# Altium schematic sheet RF Module.SchDoc: RF MODULE
size A3; Author: Andy Nicholson; CompanyName: WSU; DrawnBy: Andy Nicholson; Engineer: Andy Nicholson; Organization: WSU; DocumentNumber: 1; Revision: 2; SheetNumber: 2; SheetTotal: 3; Project: CC1125; ENG_APP_DATE: 2019/11/18; DSN_APP_DATE: 2019/11/18; CHK_APP_DATE: --/--/--; ImagePath: 1
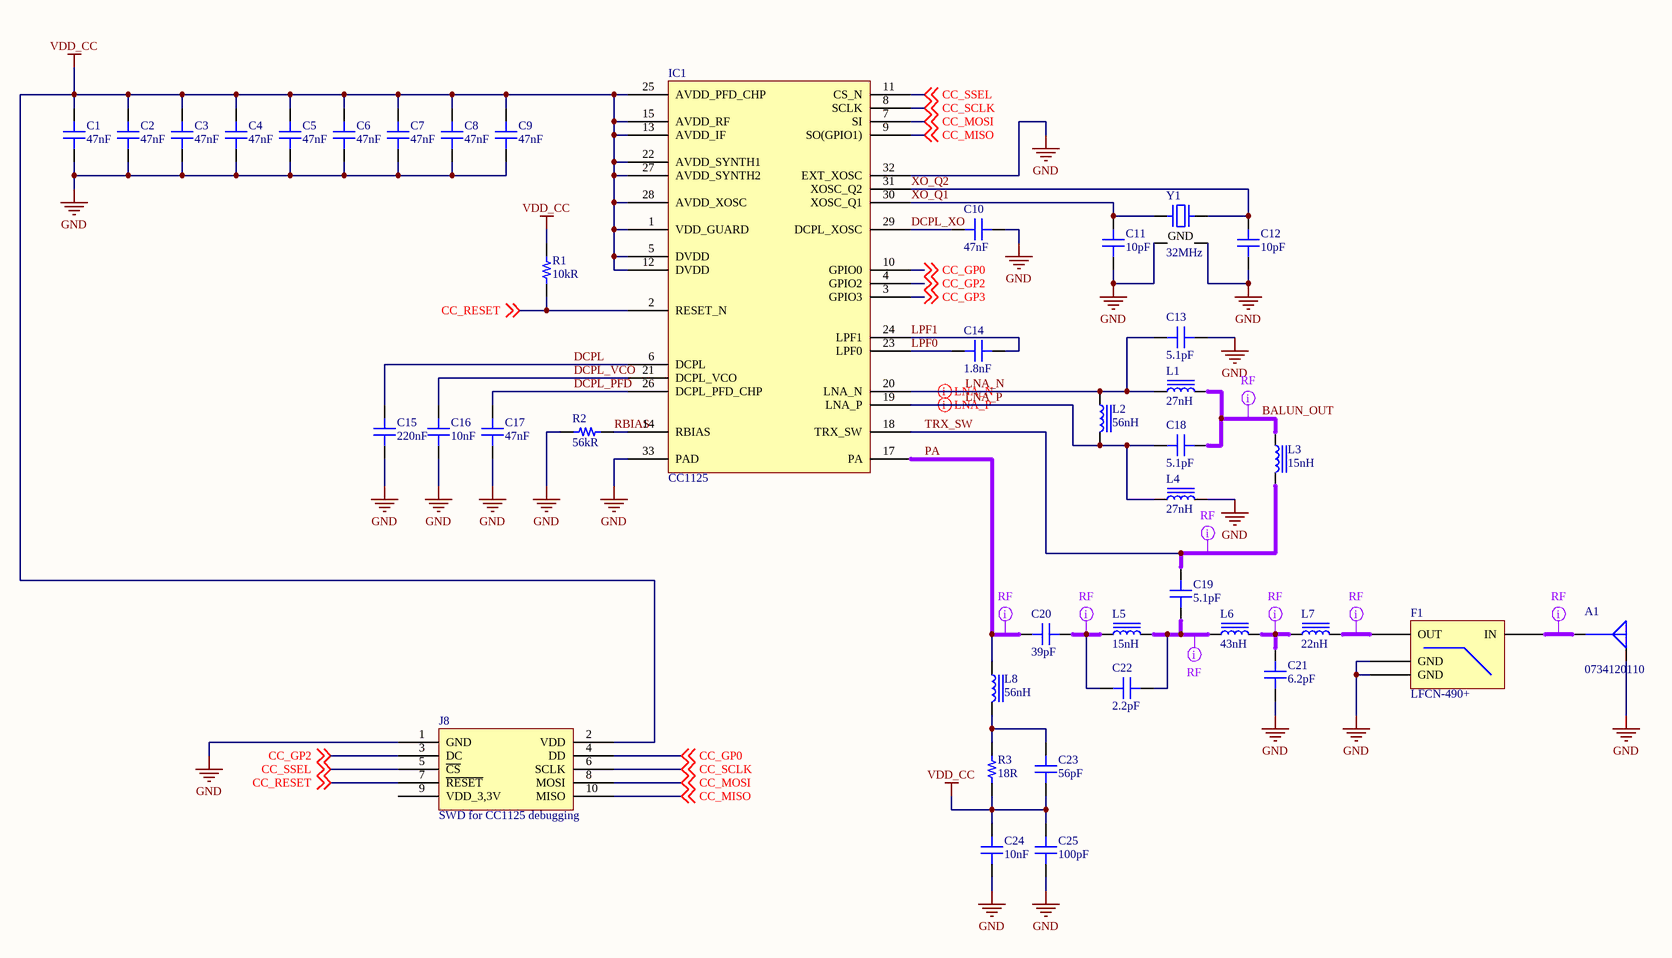
[diagram p0: RF Module.SchDoc]

## Parts
A1  0734120110  [MOLEX SD-734120110]
C1  47nF  [CAP 0402/1005]
C2  47nF  [CAP 0402/1005]
C3  47nF  [CAP 0402/1005]
C4  47nF  [CAP 0402/1005]
C5  47nF  [CAP 0402/1005]
C6  47nF  [CAP 0402/1005]
C7  47nF  [CAP 0402/1005]
C8  47nF  [CAP 0402/1005]
C9  47nF  [CAP 0402/1005]
C10  47nF  [CAP 0402/1005]
C11  10pF  [CAP 0402/1005]
C12  10pF  [CAP 0402/1005]
C13  5.1pF  [CAP 0402/1005 RF]
C14  1.8nF  [CAP 0402/1005]
C15  220nF  [CAP 0402/1005]
C16  10nF  [CAP 0402/1005]
C17  47nF  [CAP 0402/1005]
C18  5.1pF  [CAP 0402/1005 RF]
C19  5.1pF  [CAP 0402/1005 RF]
C20  39pF  [CAP 0402/1005 RF]
C21  6.2pF  [CAP 0402/1005 RF]
C22  2.2pF  [CAP 0402/1005 RF]
C23  56pF  [CAP 0402/1005 RF]
C24  10nF  [CAP 0402/1005 RF]
C25  100pF  [CAP 0402/1005 RF]
F1  LFCN-490+  [PCB - RF FILTER - MINICIRCUITS FV1206]
IC1  CC1125  [PCB - LEADLESS - QFN - TI PVQFN-32 5X5MM RHB]
J8  SWD for CC1125 debugging  [10 Pin SWD]  (no BOM)
L1  27nH  [IND 0402/1005 RF WW]
L2  56nH  [IND 0402/1005 RF WW]
L3  15nH  [IND 0402/1005 RF WW]
L4  27nH  [IND 0402/1005 RF WW]
L5  15nH  [IND 0402/1005 RF WW]
L6  43nH  [IND 0402/1005 RF WW]
L7  22nH  [IND 0402/1005 RF WW]
L8  56nH  [IND 0402/1005 RF WW]
R1  10kR  [RES 0402/1005]
R2  56kR  [RES 0402/1005]
R3  18R  [RES 0402/1005]
Y1  32MHz  [ABRACON ABM8G]

## Nets
GND: A1.G C1.1 C2.1 C3.1 C4.1 C5.1 C6.1 C7.1 C8.1 C9.1 C10.1 C11.1 C12.1 C13.2 C15.1 C16.1 C17.1 C21.1 C24.1 C25.1 F1.2(GND) F1.4(GND) IC1.32(EXT_XOSC) IC1.33(PAD) J8.1(GND) L4.2 R2.2 Y1.2(GND) Y1.4(GND)
VDD_CC: C1.2 C2.2 C3.2 C4.2 C5.2 C6.2 C7.2 C8.2 C9.2 C23.1 C24.2 C25.2 IC1.1(VDD_GUARD) IC1.5(DVDD) IC1.12(DVDD) IC1.13(AVDD_IF) IC1.15(AVDD_RF) IC1.22(AVDD_SYNTH1) IC1.25(AVDD_PFD_CHP) IC1.27(AVDD_SYNTH2) IC1.28(AVDD_XOSC) J8.2(VDD) R1.2 R3.1
BALUN_OUT: C18.2 L1.2 L3.1
CC_GP0: IC1.10(GPIO0) J8.4(DD) ; off-sheet CC_GP0
CC_GP2: IC1.4(GPIO2) J8.3(DC) ; off-sheet CC_GP2
CC_GP3: IC1.3(GPIO3) ; off-sheet CC_GP3
CC_MISO: IC1.9(SO(GPIO1)) J8.10(MISO) ; off-sheet CC_MISO
CC_MOSI: IC1.7(SI) J8.8(MOSI) ; off-sheet CC_MOSI
CC_RESET: IC1.2(RESET_N) J8.7(~{RESET}) R1.1 ; off-sheet CC_RESET
CC_SCLK: IC1.8(SCLK) J8.6(SCLK) ; off-sheet CC_SCLK
CC_SSEL: IC1.11(CS_N) J8.5(~{CS}) ; off-sheet CC_SSEL
DCPL: C15.2 IC1.6(DCPL)
DCPL_PFD: C17.2 IC1.26(DCPL_PFD_CHP)
DCPL_VCO: C16.2 IC1.21(DCPL_VCO)
DCPL_XO: C10.2 IC1.29(DCPL_XOSC)
LNA_N: C13.1 IC1.20(LNA_N) L1.1 L2.1
LNA_P: C18.1 IC1.19(LNA_P) L2.2 L4.1
LPF0: C14.2 IC1.23(LPF0)
LPF1: C14.1 IC1.24(LPF1)
PA: C20.1 IC1.17(PA) L8.1
RBIAS: IC1.14(RBIAS) R2.1
TRX_SW: C19.2 IC1.18(TRX_SW) L3.2
XO_Q1: C11.2 IC1.30(XOSC_Q1) Y1.1
XO_Q2: C12.2 IC1.31(XOSC_Q2) Y1.3
NetA1_S: A1.S F1.1(IN)
NetC19_1: C19.1 C22.1 L5.2 L6.1
NetC20_2: C20.2 C22.2 L5.1
NetC21_2: C21.2 L6.2 L7.1
NetC23_2: C23.2 L8.2 R3.2
NetF1_3: F1.3(OUT) L7.2

Not connected (* = marked no-connect by the designer): J8 9(VDD_3,3V)

## Layout directives
differential pair: LNA_N, LNA_P
net class RF: BALUN_OUT, NetA1_S, NetC19_1, NetC20_2, NetC21_2, NetF1_3, PA, TRX_SW

## Notes on the sheet
- Title
- Size:
- Date:
- A3
- Number:
- Time:
- Revision:
- Sheet
- of
- File:

## Library data of the parts
A1 = Basic Antenna: Conn Micro Coaxial RCP 0Hz to 6GHz 50Ohm Solder ST SMD Gold Embossed T/R; Manufacturer 1: Molex; Body Material: Bronze; Body Plating: Nickel; Dielectric Material: Polymer; Frequency: 6Hz; Impedance: 50R; Connector Type: Coaxial,Male Pin; Voltage Rating: 60V; Supplier 1: Digi-Key; Supplier Part Number 1: WM5587TR-ND; Manufacturer Part Number 1: 0734120110; RoHS: Yes; Category: RF / Coaxial Connectors; Stock 1: 65000; Pricing 1: 5000=0.317120, 10000=0.295250, 15000=0.290870, 25000=0.284310 (USD); Mount: Surface Mount; Contact Plating: Gold; Contact Material: Brass,Bronze; Housing Color: Silver; Insulation Material: Polymer; Min Operating Temperature: -40°C; Max Operating Temperature: 90°C; Package Quantity: 1; Fastening Type: Snap; Packaging: Tape and Reel; Termination: Solder; Max Frequency: 6GHz; Length: 3mm; Depth: 3mm; Radiation Hardening: No; ComponentLink1URL: https://datasheet.ciiva.com/7002/734120110-sd-7002502.pdf?src-supplier=Digi-Key; ComponentLink1Description: https://datasheet.ciiva.com/7002/734120110-sd-7002502.pdf?src-supplier=Digi-Key; ComponentLink2URL: https://datasheet.ciiva.com/7002/734120110-sd-7002507.pdf?src-supplier=Digi-Key; ComponentLink2Description: https://datasheet.ciiva.com/7002/734120110-sd-7002507.pdf?src-supplier=Digi-Key
C1-C10 C17 = Capacitor: CAP CER 0.047UF 10V X7R 0402; Manufacturer 1: Yageo; Manufacturer Part Number 1: CC0402KRX7R6BB473; Tolerance: 10%; Voltage: 16V; Supplier 1: Digi-Key; Supplier Part Number 1: 311-1334-1-ND; RoHS: Yes; Category: Ceramic Capacitors; Stock 1: 121390; Pricing 1: 1=0.10000, 10=0.02500, 100=0.01100, 500=0.00784, 1000=0.00616, 2500=0.00560, 5000=0.00515 (USD); Mount: Surface Mount; Case/Package: 0402; Number of Pins: 2; Case Code (Imperial): 0402; Case Code (Metric): 1005; Min Operating Temperature: -55°C; Max Operating Temperature: 125°C; Capacitance: 47nF; Dielectric: X7R; Package Quantity: 1; Voltage Rating: 10V; Voltage Rating (DC): 10V; Packaging: Tape and Reel; Termination: SMD/SMT; Composition: Ceramic; Length: 1mm; Height: 0.5mm; Width: 0.5mm; Thickness: 0.022inch; Depth: 0.5mm; Radiation Hardening: No; REACH SVHC: Unknown; Lead Free: Lead Free; Halogen Free: Halogen Free; ComponentLink1URL: https://datasheet.ciiva.com/11788/0900766b80d84f1d-11788423.pdf?src-supplier=RSComponents; ComponentLink1Description: https://datasheet.ciiva.com/11788/0900766b80d84f1d-11788423.pdf?src-supplier=RSComponents; ComponentLink2URL: https://datasheet.ciiva.com/144/mlccorderingcode-144049.pdf?src-supplier=Digi-Key; ComponentLink2Description: https://datasheet.ciiva.com/144/mlccorderingcode-144049.pdf?src-supplier=Digi-Key; ComponentLink3URL: https://datasheet.ciiva.com/144/mlccorderingcode-144050.pdf?src-supplier=Digi-Key; ComponentLink3Description: https://datasheet.ciiva.com/144/mlccorderingcode-144050.pdf?src-supplier=Digi-Key; ComponentLink4URL: https://datasheet.ciiva.com/144/mlccorderingcode-144051.pdf?src-supplier=Digi-Key; ComponentLink4Description: https://datasheet.ciiva.com/144/mlccorderingcode-144051.pdf?src-supplier=Digi-Key; ComponentLink5URL: https://datasheet.ciiva.com/7978/1489800-7978104.pdf?src-supplier=Element14; ComponentLink5Description: https://datasheet.ciiva.com/7978/1489800-7978104.pdf?src-supplier=Element14; ComponentLink6URL: https://datasheet.ciiva.com/11587/upy-gphc-x7r-6-3v-to-50v-8-11587304.pdf?src-supplier=Avnet; ComponentLink6Description: https://datasheet.ciiva.com/11587/upy-gphc-x7r-6-3v-to-50v-8-11587304.pdf?src-supplier=Avnet
C11 C12 = Capacitor: CAP CER 10PF 50V C0G/NPO 0402; Manufacturer 1: Yageo; Manufacturer Part Number 1: CC0402JRNPO9BN100; Dielectric Material: Ceramic; Tolerance: 5%; Dielectric: C0G; Temperature Coefficient: 30ppm/°C; Insulation Resistance: 100GR; Supplier 1: Digi-Key; Supplier Part Number 1: 311-1014-1-ND; RoHS: Yes; Category: Ceramic Capacitors; Stock 1: 1186868; Pricing 1: 1=0.10000, 10=0.02800, 100=0.01230, 500=0.00878, 1000=0.00690, 2500=0.00628, 5000=0.00577 (USD); Mount: Surface Mount; Case/Package: 0402; Number of Pins: 2; Case Code (Metric): 1005; Case Code (Imperial): 0402; Min Operating Temperature: -55°C; Max Operating Temperature: 125°C; Capacitance: 10pF; Packaging: Tape and Reel; Voltage Rating: 50V; Voltage Rating (DC): 50V; Package Quantity: 1; Termination: SMD/SMT; Composition: Ceramic; Voltage: 50V; Length: 1mm; Height: 0.5mm; Width: 0.02inch; Thickness: 0.022inch; Depth: 0.5mm; Radiation Hardening: No; REACH SVHC: No SVHC; Lead Free: Lead Free; ComponentLink1URL: https://datasheet.ciiva.com/11786/0900766b8079c870-11786158.pdf?src-supplier=RSComponents; ComponentLink1Description: https://datasheet.ciiva.com/11786/0900766b8079c870-11786158.pdf?src-supplier=RSComponents; ComponentLink2URL: https://datasheet.ciiva.com/28450/1443161-28450213.pdf?src-supplier=Element14; ComponentLink2Description: https://datasheet.ciiva.com/28450/1443161-28450213.pdf?src-supplier=Element14; ComponentLink3URL: https://datasheet.ciiva.com/8033/1443161-8033591.pdf?src-supplier=Element14; ComponentLink3Description: https://datasheet.ciiva.com/8033/1443161-8033591.pdf?src-supplier=Element14; ComponentLink4URL: https://datasheet.ciiva.com/143/mlccorderingcode-143992.pdf?src-supplier=Digi-Key; ComponentLink4Description: https://datasheet.ciiva.com/143/mlccorderingcode-143992.pdf?src-supplier=Digi-Key; ComponentLink5URL: https://datasheet.ciiva.com/143/mlccorderingcode-143994.pdf?src-supplier=Digi-Key; ComponentLink5Description: https://datasheet.ciiva.com/143/mlccorderingcode-143994.pdf?src-supplier=Digi-Key; ComponentLink6URL: https://datasheet.ciiva.com/8033/1443161-8033596.pdf?src-supplier=Element14; ComponentLink6Description: https://datasheet.ciiva.com/8033/1443161-8033596.pdf?src-supplier=Element14; ComponentLink7URL: https://datasheet.ciiva.com/17437/upy-gp-np0-16v-to-50v-8-17437543.pdf?src-supplier=Avnet+Europe; ComponentLink7Description: https://datasheet.ciiva.com/17437/upy-gp-np0-16v-to-50v-8-17437543.pdf?src-supplier=Avnet+Europe; ComponentLink8URL: https://datasheet.ciiva.com/143/mlccorderingcode-143993.pdf?src-supplier=Digi-Key; ComponentLink8Description: https://datasheet.ciiva.com/143/mlccorderingcode-143993.pdf?src-supplier=Digi-Key; ComponentLink9URL: https://datasheet.ciiva.com/8033/1443161-8033593.pdf?src-supplier=Element14; ComponentLink9Description: https://datasheet.ciiva.com/8033/1443161-8033593.pdf?src-supplier=Element14; ComponentLink10URL: https://datasheet.ciiva.com/5427/upy-gp-np0-16v-to-50v-8-5427741.pdf?src-supplier=Mouser; ComponentLink10Description: https://datasheet.ciiva.com/5427/upy-gp-np0-16v-to-50v-8-5427741.pdf?src-supplier=Mouser
C13 C18 C19 = Capacitor: CAP CER 5.1PF 50V C0G/NP0 0402; Manufacturer 1: Murata; Manufacturer Part Number 1: GJM1555C1H5R1CB01D; Dielectric: C0G; Supplier 1: Digi-Key; Supplier Part Number 1: 490-3102-1-ND; RoHS: Yes; Category: Ceramic Capacitors; Stock 1: 188020; Pricing 1: 1=0.12000, 10=0.08200, 100=0.03850, 500=0.02700, 1000=0.02236, 2500=0.02081, 5000=0.01904 (USD); Mount: Surface Mount; Case/Package: 0402; Case Code (Imperial): 0402; Case Code (Metric): 1005; Min Operating Temperature: -55°C; Max Operating Temperature: 125°C; Packaging: Tape and Reel; Capacitance: 5.1pF; Package Quantity: 1; Voltage Rating: 50V; Termination: SMD/SMT; Voltage: 50V; Voltage Rating (DC): 50V; Length: 1mm; Height: 0.5mm; Width: 0.02inch; Thickness: 0.022inch; Depth: 0.5mm; Radiation Hardening: No; Lead Free: Lead Free; ComponentLink1URL: https://datasheet.ciiva.com/11612/product-11612657.pdf?src-supplier=Avnet; ComponentLink1Description: https://datasheet.ciiva.com/11612/product-11612657.pdf?src-supplier=Avnet; ComponentLink2URL: https://datasheet.ciiva.com/133/partnumbering-e-01-133114.pdf?src-supplier=Digi-Key; ComponentLink2Description: https://datasheet.ciiva.com/133/partnumbering-e-01-133114.pdf?src-supplier=Digi-Key; ComponentLink3URL: https://datasheet.ciiva.com/133/partnumbering-e-01-133115.pdf?src-supplier=Digi-Key; ComponentLink3Description: https://datasheet.ciiva.com/133/partnumbering-e-01-133115.pdf?src-supplier=Digi-Key; ComponentLink4URL: https://datasheet.ciiva.com/133/partnumbering-e-01-133116.pdf?src-supplier=Digi-Key; ComponentLink4Description: https://datasheet.ciiva.com/133/partnumbering-e-01-133116.pdf?src-supplier=Digi-Key
C14 = Capacitor: CAP CER 1800PF 50V X7R 0402; Manufacturer 1: Murata; Manufacturer Part Number 1: GCM155R71H182KA37D; Tolerance: 10%; Supplier 1: Digi-Key; Supplier Part Number 1: 490-14429-1-ND; RoHS: No; Category: Ceramic Capacitors; Stock 1: 49462; Pricing 1: 1=0.10000, 10=0.03200, 100=0.01430, 500=0.01022, 1000=0.00803, 2500=0.00730, 5000=0.00671 (USD); Mount: Surface Mount; Case/Package: 0402; Case Code (Imperial): 0402; Case Code (Metric): 1005; Min Operating Temperature: -55°C; Max Operating Temperature: 125°C; Packaging: Cut Tape; Capacitance: 1.8nF; Voltage Rating: 50V; Ratings: AEC-Q200; ComponentLink1URL: http://search.murata.co.jp/Ceramy/image/img/A01X/partnumbering_e_02.pdf?src-supplier=Digi-Key; ComponentLink1Description: http://search.murata.co.jp/Ceramy/image/img/A01X/partnumbering_e_02.pdf?src-supplier=Digi-Key; ComponentLink2URL: http://search.murata.co.jp/Ceramy/image/img/A01X/G101/ENG/GCM155R71H182KA37-01.pdf?src-supplier=Digi-Key; ComponentLink2Description: http://search.murata.co.jp/Ceramy/image/img/A01X/G101/ENG/GCM155R71H182KA37-01.pdf?src-supplier=Digi-Key
C15 = Capacitor: Cap Ceramic 0.22uF 10V X7R 10% SMD 0402 125C Paper T/R; Manufacturer 1: Samsung; Manufacturer Part Number 1: CL05B224KP5NNNC; Supplier 1: Digi-Key; Supplier Part Number 1: 1276-1539-1-ND; RoHS: Yes; Category: Ceramic Capacitors; Stock 1: 360286; Pricing 1: 1=0.10000, 10=0.05000, 100=0.02210, 500=0.01576, 1000=0.01238, 2500=0.01125, 5000=0.01035 (USD); Mount: Surface Mount; Case/Package: 0402; Case Code (Metric): 1005; Case Code (Imperial): 0402; Min Operating Temperature: -55°C; Max Operating Temperature: 125°C; Capacitance: 220nF; Tolerance: 10%; Dielectric: X7R; Package Quantity: 1; Packaging: Tape and Reel; Voltage Rating: 10V; Voltage Rating (DC): 10V; Length: 1mm; Height: 0.5mm; Width: 0.02inch; Thickness: 0.022inch; Depth: 0.5mm; Radiation Hardening: No; Lead Free: Lead Free; ComponentLink1URL: https://datasheet.ciiva.com/25733/cl05b224kp5nnnc-25733649.pdf?src-supplier=Digi-Key; ComponentLink1Description: https://datasheet.ciiva.com/25733/cl05b224kp5nnnc-25733649.pdf?src-supplier=Digi-Key; ComponentLink2URL: https://datasheet.ciiva.com/26838/getdatasheetpartid-455373-26838229.pdf?src-supplier=Verical; ComponentLink2Description: https://datasheet.ciiva.com/26838/getdatasheetpartid-455373-26838229.pdf?src-supplier=Verical
C16 = Capacitor: TAIYO YUDEN - TMK105B7103KV-F - CERAMIC CAPACITOR 0.01UF, 25V, X7R, 10%, 0402, FULL REEL; Supplier 1: Digi-Key; Supplier Part Number 1: 587-1223-1-ND; Manufacturer 1: Taiyo Yuden; Manufacturer Part Number 1: TMK105B7103KV-F; RoHS: Yes; Category: Ceramic Capacitors; Stock 1: 1448575; Pricing 1: 1=0.10000, 10=0.01700, 100=0.00780, 500=0.00554, 1000=0.00436, 2500=0.00396, 5000=0.00364 (USD); Mount: Surface Mount; Case/Package: 0402; Case Code (Metric): 1005; Case Code (Imperial): 0402; Contact Plating: Tin; Min Operating Temperature: -55°C; Max Operating Temperature: 125°C; Capacitance: 10nF; Tolerance: 10%; Package Quantity: 1; Voltage Rating: 25V; Packaging: Tape and Reel; Voltage Rating (DC): 25V; Dielectric: X7R; Termination: SMD/SMT; Composition: Ceramic; Voltage: 25V; Length: 1mm; Height: 0.5mm; Width: 0.02inch; Thickness: 0.022inch; Depth: 0.5mm; REACH SVHC: Unknown; Halogen Free: Halogen Free; ComponentLink1URL: https://datasheet.ciiva.com/129/tmk105b7103kv-f-ss-129699.pdf?src-supplier=Digi-Key; ComponentLink1Description: https://datasheet.ciiva.com/129/tmk105b7103kv-f-ss-129699.pdf?src-supplier=Digi-Key; ComponentLink2URL: https://datasheet.ciiva.com/30192/438tmk105b7103kv-f-30192315.pdf?src-supplier=Onlinecomponents.com; ComponentLink2Description: https://datasheet.ciiva.com/30192/438tmk105b7103kv-f-30192315.pdf?src-supplier=Onlinecomponents.com; ComponentLink3URL: https://datasheet.ciiva.com/15922/204tmk105b7103kv-f-15922348.pdf?src-supplier=Onlinecomponents.com; ComponentLink3Description: https://datasheet.ciiva.com/15922/204tmk105b7103kv-f-15922348.pdf?src-supplier=Onlinecomponents.com; ComponentLink4URL: https://datasheet.ciiva.com/30156/190tmk105b7103kv-f-30156174.pdf?src-supplier=Onlinecomponents.com; ComponentLink4Description: https://datasheet.ciiva.com/30156/190tmk105b7103kv-f-30156174.pdf?src-supplier=Onlinecomponents.com; ComponentLink5URL: https://datasheet.ciiva.com/7975/746258-7975835.pdf?src-supplier=Element14; ComponentLink5Description: https://datasheet.ciiva.com/7975/746258-7975835.pdf?src-supplier=Element14; ComponentLink6URL: https://datasheet.ciiva.com/28645/746258-28645254.pdf?src-supplier=Element14; ComponentLink6Description: https://datasheet.ciiva.com/28645/746258-28645254.pdf?src-supplier=Element14
C20 = Capacitor: KEMET         CBR04C390J5GAC             CAPACITOR, RF, 39PF, 50V, 0402                          New; Tolerance: 5%; Supplier 1: Digi-Key; Supplier Part Number 1: 399-17685-1-ND; Manufacturer 1: KEMET; Manufacturer Part Number 1: CBR04C390J5GAC; RoHS: No; Stock 1: 23180; Pricing 1: 1=0.27000, 10=0.18500, 100=0.09380, 500=0.06414, 1000=0.05675, 2500=0.05428, 5000=0.04935 (USD); Case/Package: 0402; Case Code (Metric): 1005; Case Code (Imperial): 0402; Max Operating Temperature: 125°C; Capacitance: 39pF; Voltage Rating: 50V; Packaging: Cut Tape; Voltage Rating (DC): 50V; REACH SVHC: No SVHC; ComponentLink1URL: http://www.farnell.com/datasheets/1446011.pdf?src-supplier=Element14; ComponentLink1Description: http://www.farnell.com/datasheets/1446011.pdf?src-supplier=Element14
C21 = Capacitor: KEMET         CBR04C629B5GAC             CAPACITOR, RF, 6.2PF, 50V, 0402                          New; Supplier 1: Digi-Key; Supplier Part Number 1: 399-16105-1-ND; Manufacturer 1: KEMET; Manufacturer Part Number 1: CBR04C629B5GAC; RoHS: No; Category: Ceramic Capacitors; Stock 1: 6814; Pricing 1: 1=0.20000, 10=0.13600, 100=0.06880, 500=0.04704, 1000=0.04162, 2500=0.03981, 5000=0.03619 (USD); Case/Package: 0402; Case Code (Metric): 1005; Case Code (Imperial): 0402; Max Operating Temperature: 125°C; Capacitance: 6.2pF; Voltage Rating: 50V; Packaging: Cut Tape; Voltage Rating (DC): 50V; REACH SVHC: No SVHC; ComponentLink1URL: https://api.kemet.com/component-edge/download/datasheet/CBR04C629B5GAC.pdf?src-supplier=Digi-Key; ComponentLink1Description: https://api.kemet.com/component-edge/download/datasheet/CBR04C629B5GAC.pdf?src-supplier=Digi-Key; ComponentLink2URL: http://www.farnell.com/datasheets/1446011.pdf?src-supplier=Element14; ComponentLink2Description: http://www.farnell.com/datasheets/1446011.pdf?src-supplier=Element14
C22 = Capacitor: KEMET 2.2pF Multilayer Ceramic Capacitor (MLCC) 50 V dc 0.25pF C0G dielectric C, CBR SMD max op. temp. +125C; Manufacturer Part Number 1: CBR04C229C5GAC; Voltage Rating: 50V; Temperature Coefficient: 30ppm/°C; Supplier 1: Digi-Key; Supplier Part Number 1: 399-6164-1-ND; Manufacturer 1: KEMET; RoHS: Yes; Category: Ceramic Capacitors; Stock 1: 8531; Pricing 1: 1=0.15000, 10=0.10700, 100=0.05010, 500=0.03512, 1000=0.02908, 2500=0.02706, 5000=0.02476 (USD); Mount: Surface Mount; Case/Package: 0402; Weight: 2.3E-05oz; Case Code (Metric): 1005; Case Code (Imperial): 0402; Dielectric Material: Ceramic; Min Operating Temperature: -55°C; Max Operating Temperature: 125°C; Capacitance: 2.2pF; Packaging: Tape and Reel; Termination: SMD/SMT; Package Quantity: 1; Voltage Rating (DC): 50V; Dielectric: C0G; Voltage: 50V; Length: 1mm; Height: 0.5mm; Width: 0.02inch; Thickness: 0.022inch; Depth: 0.5mm; Radiation Hardening: No; REACH SVHC: No SVHC; ComponentLink1URL: https://datasheet.ciiva.com/22826/0900766b81140870-22826295.pdf?src-supplier=RSComponents; ComponentLink1Description: https://datasheet.ciiva.com/22826/0900766b81140870-22826295.pdf?src-supplier=RSComponents; ComponentLink2URL: https://datasheet.ciiva.com/156/kem-c1030-cbr-smd-156418.pdf?src-supplier=Digi-Key; ComponentLink2Description: https://datasheet.ciiva.com/156/kem-c1030-cbr-smd-156418.pdf?src-supplier=Digi-Key; ComponentLink3URL: https://datasheet.ciiva.com/156/kem-c1030-cbr-smd-156419.pdf?src-supplier=Digi-Key; ComponentLink3Description: https://datasheet.ciiva.com/156/kem-c1030-cbr-smd-156419.pdf?src-supplier=Digi-Key; ComponentLink4URL: https://datasheet.ciiva.com/156/kem-c1030-cbr-smd-156420.pdf?src-supplier=Digi-Key; ComponentLink4Description: https://datasheet.ciiva.com/156/kem-c1030-cbr-smd-156420.pdf?src-supplier=Digi-Key; ComponentLink5URL: https://datasheet.ciiva.com/22694/1446011-22694698.pdf?src-supplier=Element14; ComponentLink5Description: https://datasheet.ciiva.com/22694/1446011-22694698.pdf?src-supplier=Element14; ComponentLink6URL: https://datasheet.ciiva.com/1461/1446011-1461900.pdf?src-supplier=Element14; ComponentLink6Description: https://datasheet.ciiva.com/1461/1446011-1461900.pdf?src-supplier=Element14
C23 = Capacitor: Cap Ceramic 56pF 50V C0G 1% SMD 0402 125°C Paper T/R; Manufacturer 1: KEMET; Manufacturer Part Number 1: CBR04C560F5GAC; Supplier 1: Digi-Key; Supplier Part Number 1: 399-16100-1-ND; RoHS: Yes; Category: Ceramic Capacitors; Stock 1: 28423; Pricing 1: 1=0.55000, 10=0.39100, 100=0.25740, 500=0.19068, 1000=0.16208, 2500=0.15254, 5000=0.14301 (USD); Case/Package: 0402; Weight: 2.3E-05oz; Case Code (Imperial): 0402; Case Code (Metric): 1005; Min Operating Temperature: -55°C; Max Operating Temperature: 125°C; Capacitance: 56pF; Dielectric: C0G; Packaging: Tape and Reel; Termination: SMD/SMT; Voltage Rating (DC): 50V; Tolerance: 1%; Package Quantity: 10000; Length: 1mm; Height: 0.5mm; Width: 0.5mm; ComponentLink1URL: http://www.farnell.com/datasheets/2373108.pdf?src-supplier=Farnell; ComponentLink1Description: http://www.farnell.com/datasheets/2373108.pdf?src-supplier=Farnell; ComponentLink2URL: http://www.mouser.com/ds/2/212/KEM_C1030_CBR_SMD-346920.pdf?src-supplier=Mouser; ComponentLink2Description: http://www.mouser.com/ds/2/212/KEM_C1030_CBR_SMD-346920.pdf?src-supplier=Mouser; ComponentLink3URL: https://api.kemet.com/component-edge/download/datasheet/CBR04C560F5GAC.pdf?src-supplier=Digi-Key; ComponentLink3Description: https://api.kemet.com/component-edge/download/datasheet/CBR04C560F5GAC.pdf?src-supplier=Digi-Key
C24 = Capacitor: Cap Ceramic 0.01uF 16V X7R 5% SMD 0402 125C Paper T/R; Manufacturer 1: Samsung; Manufacturer Part Number 1: CL05B103JO5NNNC; Supplier 1: Digi-Key; Supplier Part Number 1: 1276-1496-1-ND; RoHS: Yes; Category: Ceramic Capacitors; Stock 1: 288059; Pricing 1: 1=0.10000, 10=0.02700, 100=0.01190, 500=0.00848, 1000=0.00666, 2500=0.00605, 5000=0.00557 (USD); Mount: Surface Mount; Case/Package: 0402; Case Code (Metric): 1005; Case Code (Imperial): 0402; Min Operating Temperature: -55°C; Max Operating Temperature: 125°C; Capacitance: 10nF; Tolerance: 5%; Dielectric: X7R; Package Quantity: 10000; Packaging: Tape and Reel; Voltage Rating: 16V; Voltage Rating (DC): 16V; Length: 1mm; Height: 0.5mm; Width: 0.02inch; Thickness: 0.022inch; Depth: 0.5mm; Radiation Hardening: No; ComponentLink1URL: https://datasheet.ciiva.com/25738/cl05b103jo5nnnc-25738915.pdf?src-supplier=Digi-Key; ComponentLink1Description: https://datasheet.ciiva.com/25738/cl05b103jo5nnnc-25738915.pdf?src-supplier=Digi-Key; ComponentLink2URL: https://datasheet.ciiva.com/26822/getdatasheetpartid-357639-26822697.pdf?src-supplier=Verical; ComponentLink2Description: https://datasheet.ciiva.com/26822/getdatasheetpartid-357639-26822697.pdf?src-supplier=Verical
C25 = Capacitor: CAP CER SMD CBR 0402 100PF 5% 25; Manufacturer 1: KEMET; Manufacturer Part Number 1: CBR04C101J3GAC; Voltage Rating: 25V; Supplier 1: Digi-Key; Supplier Part Number 1: 399-17684-1-ND; RoHS: No; Stock 1: 11336; Pricing 1: 1=0.25000, 10=0.16800, 100=0.08520, 500=0.05832, 1000=0.05159, 2500=0.04935, 5000=0.04486 (USD); Mount: Surface Mount; Case/Package: 0402; Case Code (Imperial): 0402; Case Code (Metric): 1005; Min Operating Temperature: -55°C; Max Operating Temperature: 125°C; Packaging: Cut Tape; Capacitance: 100pF; Tolerance: 5%; ComponentLink1URL: https://api.kemet.com/component-edge/download/datasheet/CBR04C101J3GAC.pdf?src-supplier=Digi-Key; ComponentLink1Description: https://api.kemet.com/component-edge/download/datasheet/CBR04C101J3GAC.pdf?src-supplier=Digi-Key
F1 = SCH - RF - FILTER - MINICIRCUITS LFCN-490: 490MHz Low Pass Filter
IC1 = SCH - RF - IC - TI CC1120: RF Transceiver Ultra-Hi Perf RF Narrowbd Transceiver; Manufacturer 1: Texas Instruments; Manufacturer Part Number 1: CC1125RHBT; Frequency: 960MHz; Interface: SPI; Max Supply Voltage: 3.6V; Min Supply Voltage: 2V; Data Rate: 200Kbps; Sensitivity: -120dBm; Current - Receiving: 27mA; Current - Transmitting: 56mA; Memory Size: 256B; Number of GPIO: 4; Density: 0B; Number of Receivers: 1; Supplier 1: Digi-Key; Supplier Part Number 1: 296-38891-1-ND; RoHS: Yes; Category: Interface ICs; Stock 1: 160; Pricing 1: 1=6.66000, 10=5.94800, 25=5.35360, 100=4.87760 (USD); Mount: Surface Mount; Case/Package: VQFN; Number of Pins: 32; Contact Plating: Gold,Silver; Min Operating Temperature: -40°C; Max Operating Temperature: 85°C; Packaging: Tape and Reel; Package Quantity: 250; Max Frequency: 960MHz; Number of Transmitters: 1; Lead Free: Lead Free; REACH SVHC: No SVHC; ComponentLink1URL: https://datasheet.ciiva.com/12179/swrs120a-224860-12179361.pdf?src-supplier=Mouser; ComponentLink1Description: https://datasheet.ciiva.com/12179/swrs120a-224860-12179361.pdf?src-supplier=Mouser; ComponentLink2URL: https://datasheet.ciiva.com/46417/1816568-46417707.pdf?src-supplier=Element14; ComponentLink2Description: https://datasheet.ciiva.com/46417/1816568-46417707.pdf?src-supplier=Element14; ComponentLink3URL: https://datasheet.ciiva.com/46417/1816568-46417708.pdf?src-supplier=Element14; ComponentLink3Description: https://datasheet.ciiva.com/46417/1816568-46417708.pdf?src-supplier=Element14
J8 = SWD_CC
L1 L4 = Inductor: Inductor RF Chip Unshielded Wirewound 27nH 2% 100MHz 30Q-Factor Non Magnetic 680mA 288mOhm DCR 0402 T/R; Manufacturer 1: Murata; Manufacturer Part Number 1: LQW15AN27NG80D; Core Material: Ferrite; DC Resistance (DCR): 288mR; Self Resonant Frequency: 4GHz; Q Factor: 30; Supplier 1: Digi-Key; Supplier Part Number 1: 490-18129-1-ND; RoHS: Yes; Category: Fixed Inductors; Stock 1: 4331; Pricing 1: 1=0.25000, 10=0.22100, 100=0.15180, 500=0.12972, 1000=0.09936, 2500=0.09384 (USD); Mount: Surface Mount; Case/Package: 0402; Case Code (Metric): 1005; Case Code (Imperial): 0402; Min Operating Temperature: -55°C; Max Operating Temperature: 125°C; Tolerance: 2%; Current Rating: 680mA; Shielding: Unshielded; Packaging: Tape and Reel; Package Quantity: 10000; Composition: Wirewound; Inductance: 27nH; Test Frequency: 100MHz; Max DC Current: 680mA; Termination: SMD/SMT; Length: 0.039inch; Height: 0.5mm; Width: 0.024inch; Height - Seated (Max): 0.024inch; ComponentLink1URL: https://datasheet.ciiva.com/24050/product-24050902.pdf?src-supplier=Mouser; ComponentLink1Description: https://datasheet.ciiva.com/24050/product-24050902.pdf?src-supplier=Mouser
L2 L8 = Inductor: Fixed Inductors 56nH 2%; Manufacturer 1: Murata; Manufacturer Part Number 1: LQW15AN56NG00D; Core Material: Air,Ferrite; DC Resistance (DCR): 1.17R; Max DC Current: 200mA; Shielding: Unshielded; Q Factor: 25; Self Resonant Frequency: 2.8GHz; Test Frequency: 100MHz; Current: 700mA; Supplier 1: Digi-Key; Supplier Part Number 1: 490-6830-1-ND; RoHS: Yes; Category: Fixed Inductors; Stock 1: 20707; Pricing 1: 1=0.19000, 10=0.17100, 100=0.11390, 500=0.09488, 1000=0.07970, 2500=0.06831 (USD); Mount: Surface Mount; Case/Package: 0402; Weight: 2.8E-05oz; Case Code (Metric): 1005; Case Code (Imperial): 0402; Min Operating Temperature: -55°C; Max Operating Temperature: 125°C; Tolerance: 2%; Inductance: 56nH; Package Quantity: 10000; Current Rating: 200mA; Packaging: Tape and Reel; Termination: SMD/SMT; DC Current: 200mA; Military Standard: Not; Length: 1mm; Height: 0.5mm; Width: 0.02inch; Depth: 0.6mm; Radiation Hardening: No; Lead Free: Lead Free; ComponentLink1URL: https://datasheet.ciiva.com/11799/0900766b8090d800-11799113.pdf?src-supplier=RSComponents; ComponentLink1Description: https://datasheet.ciiva.com/11799/0900766b8090d800-11799113.pdf?src-supplier=RSComponents; ComponentLink2URL: https://datasheet.ciiva.com/6709/l0075s0080lqw15a-00-6709925.pdf?src-supplier=Digi-Key; ComponentLink2Description: https://datasheet.ciiva.com/6709/l0075s0080lqw15a-00-6709925.pdf?src-supplier=Digi-Key; ComponentLink3URL: https://datasheet.ciiva.com/8507/l0075s0080lqw15a-00-8507590.pdf?src-supplier=Avnet; ComponentLink3Description: https://datasheet.ciiva.com/8507/l0075s0080lqw15a-00-8507590.pdf?src-supplier=Avnet; ComponentLink4URL: https://datasheet.ciiva.com/6709/l0075s0080lqw15a-00-6709927.pdf?src-supplier=Digi-Key; ComponentLink4Description: https://datasheet.ciiva.com/6709/l0075s0080lqw15a-00-6709927.pdf?src-supplier=Digi-Key; ComponentLink5URL: https://datasheet.ciiva.com/6709/l0075s0080lqw15a-00-6709929.pdf?src-supplier=Digi-Key; ComponentLink5Description: https://datasheet.ciiva.com/6709/l0075s0080lqw15a-00-6709929.pdf?src-supplier=Digi-Key; ComponentLink6URL: https://datasheet.ciiva.com/4976/product-4976445.pdf?src-supplier=Mouser; ComponentLink6Description: https://datasheet.ciiva.com/4976/product-4976445.pdf?src-supplier=Mouser; ComponentLink7URL: https://datasheet.ciiva.com/17278/l0075s0080lqw15a-00-17278510.pdf?src-supplier=Avnet+Europe; ComponentLink7Description: https://datasheet.ciiva.com/17278/l0075s0080lqw15a-00-17278510.pdf?src-supplier=Avnet+Europe
L3 L5 = Inductor: FIXED IND 15NH 1.15A 114 MOHM; Manufacturer 1: Murata; Manufacturer Part Number 1: LQW15AN15NG8ZD; Core Material: Non-Magnetic; Tolerance: 2%; Shielding: Unshielded; DC Resistance (DCR): 114mR; Self Resonant Frequency: 5.5GHz; Test Frequency: 100MHz; Frequency: 40MHz; Frequency Stability: 25ppm; Frequency Tolerance: 10ppm; Load Capacitance: 8pF; ESR (Equivalent Series Resistance): 60R; Supplier 1: Digi-Key; Supplier Part Number 1: 490-15341-1-ND; RoHS: No; Stock 1: 236; Pricing 1: 1=0.25000, 10=0.22500, 100=0.15500, 500=0.13242, 1000=0.10143, 2500=0.09580 (USD); Mount: Surface Mount; Case/Package: 0402; Case Code (Imperial): 0402; Case Code (Metric): 1005; Min Operating Temperature: -55°C; Max Operating Temperature: 125°C; Composition: Wirewound; Packaging: Cut Tape; Inductance: 15nH; Current Rating: 1.15A; Ratings: AEC-Q200; ComponentLink1URL: http://search.murata.co.jp/Ceramy/image/img/P02/JELF243A-9138.pdf?src-supplier=Digi-Key; ComponentLink1Description: http://search.murata.co.jp/Ceramy/image/img/P02/JELF243A-9138.pdf?src-supplier=Digi-Key
L6 = Inductor: Fixed Inductors 43nH 2% 100MHz; Manufacturer 1: Murata; Manufacturer Part Number 1: LQW15AN43NG00D; Core Material: Air,Ferrite; Q Factor: 25; Shielding: Unshielded; Current Rating: 250mA; Current: 200mA; DC Resistance (DCR): 700mR; Self Resonant Frequency: 3GHz; Supplier 1: Digi-Key; Supplier Part Number 1: 490-6817-1-ND; RoHS: Yes; Category: Fixed Inductors; Stock 1: 19392; Pricing 1: 1=0.19000, 10=0.17100, 100=0.11390, 500=0.09488, 1000=0.07970, 2500=0.06831 (USD); Mount: Surface Mount; Case/Package: 0402; Weight: 2.8E-05oz; Case Code (Metric): 1005; Case Code (Imperial): 0402; Min Operating Temperature: -55°C; Max Operating Temperature: 125°C; Package Quantity: 1; Tolerance: 2%; Packaging: Tape and Reel; Inductance: 43nH; Max DC Current: 250mA; Termination: SMD/SMT; Test Frequency: 100MHz; DC Current: 250mA; Military Standard: Not; Inductance Tolerance: 2%; Length: 1mm; Height: 0.5mm; Width: 0.5mm; Depth: 0.6mm; REACH SVHC: No SVHC; ComponentLink1URL: https://datasheet.ciiva.com/30488/0900766b8125623e-30488999.pdf?src-supplier=RSComponents; ComponentLink1Description: https://datasheet.ciiva.com/30488/0900766b8125623e-30488999.pdf?src-supplier=RSComponents; ComponentLink2URL: https://datasheet.ciiva.com/8507/l0075s0080lqw15a-00-8507514.pdf?src-supplier=Avnet; ComponentLink2Description: https://datasheet.ciiva.com/8507/l0075s0080lqw15a-00-8507514.pdf?src-supplier=Avnet; ComponentLink3URL: https://datasheet.ciiva.com/6709/l0075s0080lqw15a-00-6709983.pdf?src-supplier=Digi-Key; ComponentLink3Description: https://datasheet.ciiva.com/6709/l0075s0080lqw15a-00-6709983.pdf?src-supplier=Digi-Key
L7 = Inductor: FIXED IND 22NH 780MA 202 MOHM; Manufacturer 1: Murata; Manufacturer Part Number 1: LQW15AN22NG8ZD; Core Material: Non-Magnetic; Tolerance: 2%; Shielding: Unshielded; DC Resistance (DCR): 202mR; Self Resonant Frequency: 4.5GHz; Test Frequency: 100MHz; Supplier 1: Digi-Key; Supplier Part Number 1: 490-15363-1-ND; RoHS: No; Stock 1: 10361; Pricing 1: 1=0.25000, 10=0.22500, 100=0.15500, 500=0.13242, 1000=0.10143, 2500=0.09580 (USD); Mount: Surface Mount; Case/Package: 0402; Case Code (Imperial): 0402; Case Code (Metric): 1005; Min Operating Temperature: -55°C; Max Operating Temperature: 125°C; Composition: Wirewound; Packaging: Cut Tape; Inductance: 22nH; Current Rating: 780mA; Ratings: AEC-Q200; ComponentLink1URL: http://search.murata.co.jp/Ceramy/image/img/P02/JELF243A-9138.pdf?src-supplier=Digi-Key; ComponentLink1Description: http://search.murata.co.jp/Ceramy/image/img/P02/JELF243A-9138.pdf?src-supplier=Digi-Key
R1 = Resistor: RES SMD 10K OHM 5% 1/16W 0402; Manufacturer 1: Yageo; Manufacturer Part Number 1: RC0402JR-0710KL; Temperature Coefficient: 100ppm/°C; Power Rating: 62.5mW; Voltage Rating: 50V; Max Power Dissipation: 63mW; Supplier 1: Digi-Key; Supplier Part Number 1: 311-10KJRCT-ND; RoHS: Yes; Category: Chip SMD Resistors; Stock 1: 30477294; Pricing 1: 1=0.10000, 10=0.01300, 100=0.00530, 1000=0.00236, 2500=0.00205, 5000=0.00169 (USD); Case/Package: 0402; Case Code (Metric): 1005; Case Code (Imperial): 0402; Min Operating Temperature: -55°C; Max Operating Temperature: 155°C; Resistance: 10kR; Tolerance: 5%; Packaging: Tape and Reel; Package Quantity: 1; Composition: Thick Film; Number of Terminations: 2; Termination: SMD/SMT; Military Standard: Not; Features: Moisture Resistant; Length: 1mm; Height: 0.016inch; Width: 0.02inch; Depth: 0.5mm; REACH SVHC: Unknown; Lead Free: Lead Free; ComponentLink1URL: https://datasheet.ciiva.com/2452/pyu-r-int-thick-7-2452626.pdf?src-supplier=Digi-Key; ComponentLink1Description: https://datasheet.ciiva.com/2452/pyu-r-int-thick-7-2452626.pdf?src-supplier=Digi-Key; ComponentLink2URL: https://datasheet.ciiva.com/7850/1018594-7850136.pdf?src-supplier=Element14; ComponentLink2Description: https://datasheet.ciiva.com/7850/1018594-7850136.pdf?src-supplier=Element14; ComponentLink3URL: https://datasheet.ciiva.com/2452/pyu-r-int-thick-7-2452627.pdf?src-supplier=Digi-Key; ComponentLink3Description: https://datasheet.ciiva.com/2452/pyu-r-int-thick-7-2452627.pdf?src-supplier=Digi-Key; ComponentLink4URL: https://datasheet.ciiva.com/2452/pyu-r-int-thick-7-2452628.pdf?src-supplier=Digi-Key; ComponentLink4Description: https://datasheet.ciiva.com/2452/pyu-r-int-thick-7-2452628.pdf?src-supplier=Digi-Key; ComponentLink5URL: https://datasheet.ciiva.com/7850/1018594-7850137.pdf?src-supplier=Element14; ComponentLink5Description: https://datasheet.ciiva.com/7850/1018594-7850137.pdf?src-supplier=Element14; ComponentLink6URL: https://datasheet.ciiva.com/12669/pyu-rc0402-51-rohs-l-6-r-12669687.pdf?src-supplier=Mouser; ComponentLink6Description: https://datasheet.ciiva.com/12669/pyu-rc0402-51-rohs-l-6-r-12669687.pdf?src-supplier=Mouser
R2 = Resistor: RES SMD 56K OHM 5% 1/16W 0402; Manufacturer 1: Yageo; Manufacturer Part Number 1: RC0402JR-0756KL; Temperature Coefficient: 100ppm/°C; Power Rating: 63mW; Voltage Rating: 50V; Supplier 1: Digi-Key; Supplier Part Number 1: 311-56KJRCT-ND; RoHS: Yes; Category: Chip SMD Resistors; Stock 1: 498633; Pricing 1: 1=0.10000, 10=0.01300, 100=0.00530, 1000=0.00236, 2500=0.00205, 5000=0.00169 (USD); Case/Package: 0402; Weight: 2.3E-05oz; Contact Plating: Tin,Matte; Case Code (Imperial): 0402; Case Code (Metric): 1005; Min Operating Temperature: -55°C; Max Operating Temperature: 155°C; Resistance: 56kR; Tolerance: 5%; Composition: Thick Film; Packaging: Tape and Reel; Termination: SMD/SMT; Military Standard: Not; Working Voltage: 50V; Number of Terminations: 2; Length: 1mm; Height: 0.35mm; Width: 0.5mm; Depth: 0.5mm; Radiation Hardening: No; REACH SVHC: Unknown; Lead Free: Lead Free; ComponentLink1URL: https://datasheet.ciiva.com/7850/1018594-7850229.pdf?src-supplier=Element14; ComponentLink1Description: https://datasheet.ciiva.com/7850/1018594-7850229.pdf?src-supplier=Element14; ComponentLink2URL: https://datasheet.ciiva.com/12577/pyu-rc0402-51-rohs-l-6-r-12577526.pdf?src-supplier=Mouser; ComponentLink2Description: https://datasheet.ciiva.com/12577/pyu-rc0402-51-rohs-l-6-r-12577526.pdf?src-supplier=Mouser; ComponentLink3URL: https://datasheet.ciiva.com/15189/getdatasheetpartid-251833-15189574.pdf?src-supplier=Verical; ComponentLink3Description: https://datasheet.ciiva.com/15189/getdatasheetpartid-251833-15189574.pdf?src-supplier=Verical; ComponentLink4URL: https://datasheet.ciiva.com/16742/pyu-rc0402-51-rohs-l-6-r-16742167.pdf?src-supplier=Future+Electronics; ComponentLink4Description: https://datasheet.ciiva.com/16742/pyu-rc0402-51-rohs-l-6-r-16742167.pdf?src-supplier=Future+Electronics; ComponentLink5URL: https://datasheet.ciiva.com/7983/1018594-7983592.pdf?src-supplier=Element14; ComponentLink5Description: https://datasheet.ciiva.com/7983/1018594-7983592.pdf?src-supplier=Element14; ComponentLink6URL: https://datasheet.ciiva.com/16862/pyu-rc0402-51-rohs-l-6-16862495.pdf?src-supplier=Avnet+Europe; ComponentLink6Description: https://datasheet.ciiva.com/16862/pyu-rc0402-51-rohs-l-6-16862495.pdf?src-supplier=Avnet+Europe
R3 = Resistor: YAGEO (PHYCOMP)         RC0402FR-0718RL             SMD Chip Resistor, Thick Film, 18 ohm, 50 V, 0402 [1005 Metric], 63 mW,  1%, RC Series; Voltage Rating: 50V; Power Rating: 62.5mW; Temperature Coefficient: 100ppm/°C; Max Power Dissipation: 63mW; Supplier 1: Digi-Key; Supplier Part Number 1: YAG3021CT-ND; Manufacturer 1: Yageo; Manufacturer Part Number 1: RC0402FR-0718RL; RoHS: Yes; Category: Chip SMD Resistors; Stock 1: 229549; Pricing 1: 1=0.10000, 10=0.01600, 100=0.00640, 1000=0.00289, 2500=0.00251, 5000=0.00207 (USD); Case/Package: 0402; Weight: 2.3E-05oz; Case Code (Imperial): 0402; Case Code (Metric): 1005; Min Operating Temperature: -55°C; Max Operating Temperature: 155°C; Resistance: 18R; Tolerance: 1%; Packaging: Tape and Reel; Composition: Thick Film; Number of Terminations: 2; Termination: SMD/SMT; Military Standard: Not; Features: Moisture Resistant; Length: 1mm; Height: 0.016inch; Width: 0.02inch; Depth: 0.5mm; REACH SVHC: Unknown; Lead Free: Lead Free; ComponentLink1URL: https://datasheet.ciiva.com/17332/pyu-rc0402-51-rohs-l-6-17332587.pdf?src-supplier=Future+Electronics; ComponentLink1Description: https://datasheet.ciiva.com/17332/pyu-rc0402-51-rohs-l-6-17332587.pdf?src-supplier=Future+Electronics; ComponentLink2URL: https://datasheet.ciiva.com/12577/pyu-rc0402-51-rohs-l-6-r-12577388.pdf?src-supplier=Mouser; ComponentLink2Description: https://datasheet.ciiva.com/12577/pyu-rc0402-51-rohs-l-6-r-12577388.pdf?src-supplier=Mouser
Y1 = Abracon Crystal ABM8G: CRYSTAL 32.0000MHZ 10PF SMD; Manufacturer Part Number 1: ABM8G-32.000MHZ-B4Y-T; Frequency Tolerance: 30ppm; ESR (Equivalent Series Resistance): 50R; Supplier 1: Digi-Key; Supplier Part Number 1: 535-10302-1-ND; Manufacturer 1: Abracon; RoHS: Yes; Category: Crystals; Stock 1: 51278; Pricing 1: 1=0.94000, 10=0.83500, 50=0.78040, 100=0.68970, 500=0.65340 (USD); Mount: Surface Mount; Case/Package: CSMD; Number of Pins: 4; Min Operating Temperature: -20°C; Max Operating Temperature: 70°C; Package Quantity: 1000; Frequency: 32MHz; Load Capacitance: 10pF; Packaging: Tape and Reel; Tolerance: 30ppm; Frequency Stability: 30ppm; Termination: SMD/SMT; Series Resistance: 50R; Length: 3.2mm; Height: 0.039inch; Width: 0.098inch; Depth: 2.5mm; REACH SVHC: Unknown; Lead Free: Lead Free; ComponentLink1URL: https://datasheet.ciiva.com/855/abm8g-855344.pdf?src-supplier=Digi-Key; ComponentLink1Description: https://datasheet.ciiva.com/855/abm8g-855344.pdf?src-supplier=Digi-Key; ComponentLink2URL: https://datasheet.ciiva.com/3176/abm8g-3176102.pdf?src-supplier=Avnet; ComponentLink2Description: https://datasheet.ciiva.com/3176/abm8g-3176102.pdf?src-supplier=Avnet; ComponentLink3URL: https://datasheet.ciiva.com/855/abm8g-855342.pdf?src-supplier=Digi-Key; ComponentLink3Description: https://datasheet.ciiva.com/855/abm8g-855342.pdf?src-supplier=Digi-Key; ComponentLink4URL: https://datasheet.ciiva.com/4945/abm8g-10572-4945294.pdf?src-supplier=Mouser; ComponentLink4Description: https://datasheet.ciiva.com/4945/abm8g-10572-4945294.pdf?src-supplier=Mouser; ComponentLink5URL: https://datasheet.ciiva.com/855/abm8g-855343.pdf?src-supplier=Digi-Key; ComponentLink5Description: https://datasheet.ciiva.com/855/abm8g-855343.pdf?src-supplier=Digi-Key; ComponentLink6URL: https://datasheet.ciiva.com/7998/abm8g-7998639.pdf?src-supplier=Element14; ComponentLink6Description: https://datasheet.ciiva.com/7998/abm8g-7998639.pdf?src-supplier=Element14